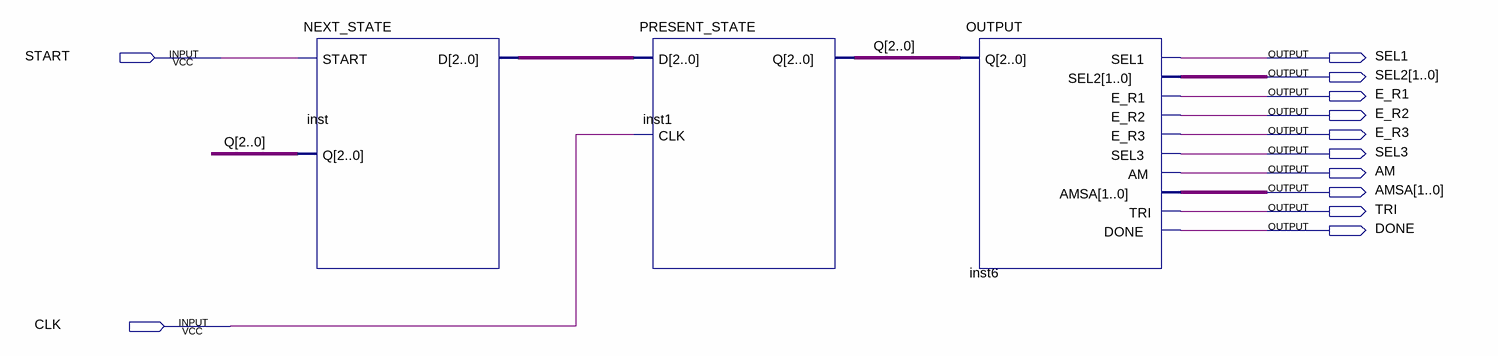
[diagram p0: schematic sheet]
// Quartus schematic Functional_Unit_Sharing_controller.bdf as structural Verilog: 3 symbols, 12 pins
module Functional_Unit_Sharing_controller (
  input  START,
  input  CLK,
  output SEL1,
  output [1:0] SEL2,
  output E_R1,
  output E_R2,
  output E_R3,
  output SEL3,
  output AM,
  output [1:0] AMSA,
  output TRI,
  output DONE
);

  wire [2:0] inst_d, Q;

  NEXT_STATE inst (.START(START), .Q(Q), .D(inst_d));
  PRESENT_STATE inst1 (.CLK(CLK), .D(inst_d), .Q(Q));
  OUTPUT inst6 (
    .Q(Q), .SEL1(SEL1), .SEL2(SEL2), .E_R1(E_R1), .E_R2(E_R2), .E_R3(E_R3), .SEL3(SEL3), .AM(AM),
    .AMSA(AMSA), .TRI(TRI), .DONE(DONE));
endmodule
